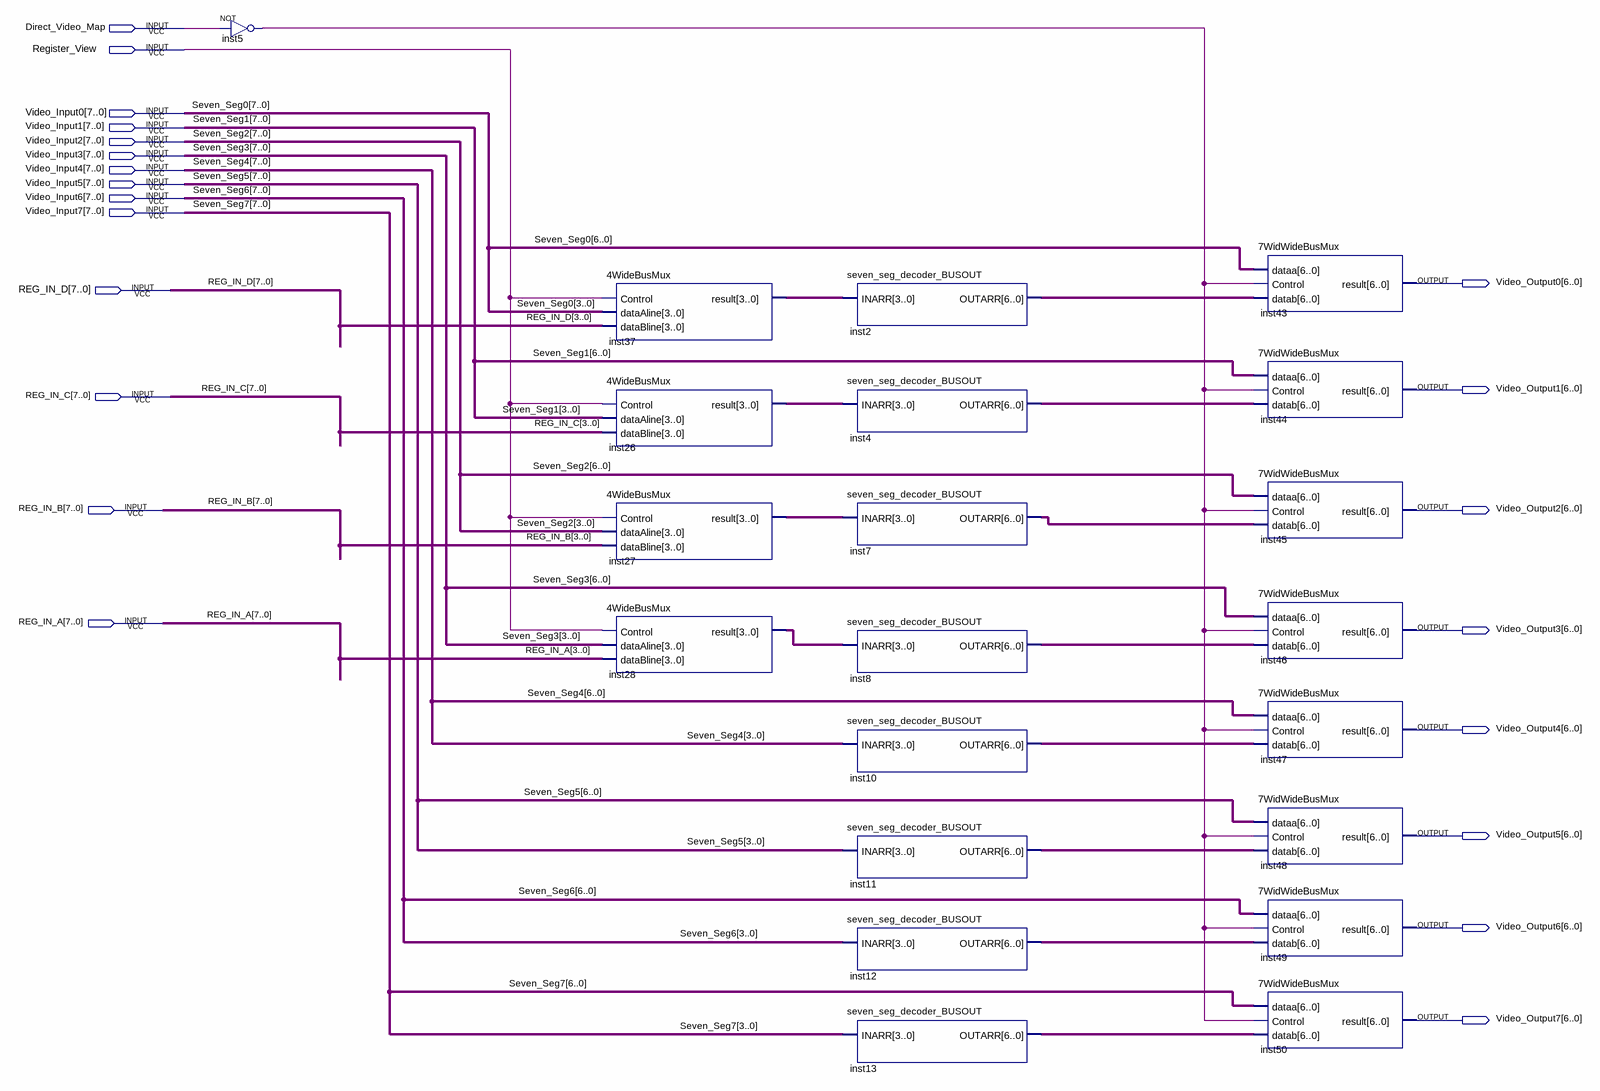
[diagram p0: schematic sheet]
// Quartus schematic Video_Card.bdf as structural Verilog: 21 symbols, 22 pins
module Video_Card (
  input  Direct_Video_Map,
  input  Register_View,
  input  [7:0] Video_Input0,
  input  [7:0] Video_Input1,
  input  [7:0] Video_Input2,
  input  [7:0] Video_Input3,
  input  [7:0] Video_Input4,
  input  [7:0] Video_Input5,
  input  [7:0] Video_Input6,
  input  [7:0] Video_Input7,
  input  [7:0] REG_IN_D,
  input  [7:0] REG_IN_C,
  input  [7:0] REG_IN_B,
  input  [7:0] REG_IN_A,
  output [6:0] Video_Output0,
  output [6:0] Video_Output1,
  output [6:0] Video_Output2,
  output [6:0] Video_Output3,
  output [6:0] Video_Output4,
  output [6:0] Video_Output5,
  output [6:0] Video_Output6,
  output [6:0] Video_Output7
);

  wire inst5_out;
  wire [3:0] inst26_result, inst27_result, inst28_result, inst37_result;
  wire [6:0] inst2_outarr, inst4_outarr, inst7_outarr, inst8_outarr, inst10_outarr, inst11_outarr,
       inst12_outarr, inst13_outarr;

  not inst5 (inst5_out, Direct_Video_Map);
  \4WideBusMux  inst37 (
    .Control(Register_View), .dataAline(Video_Input0[3:0]), .dataBline(REG_IN_D[3:0]), .result(inst37_result));
  \4WideBusMux  inst26 (
    .Control(Register_View), .dataAline(Video_Input1[3:0]), .dataBline(REG_IN_C[3:0]), .result(inst26_result));
  \4WideBusMux  inst27 (
    .Control(Register_View), .dataAline(Video_Input2[3:0]), .dataBline(REG_IN_B[3:0]), .result(inst27_result));
  \4WideBusMux  inst28 (
    .Control(Register_View), .dataAline(Video_Input3[3:0]), .dataBline(REG_IN_A[3:0]), .result(inst28_result));
  seven_seg_decoder_BUSOUT inst2 (.INARR(inst37_result), .OUTARR(inst2_outarr));
  seven_seg_decoder_BUSOUT inst4 (.INARR(inst26_result), .OUTARR(inst4_outarr));
  seven_seg_decoder_BUSOUT inst7 (.INARR(inst27_result), .OUTARR(inst7_outarr));
  seven_seg_decoder_BUSOUT inst8 (.INARR(inst28_result), .OUTARR(inst8_outarr));
  seven_seg_decoder_BUSOUT inst10 (.INARR(Video_Input4[3:0]), .OUTARR(inst10_outarr));
  seven_seg_decoder_BUSOUT inst11 (.INARR(Video_Input5[3:0]), .OUTARR(inst11_outarr));
  seven_seg_decoder_BUSOUT inst12 (.INARR(Video_Input6[3:0]), .OUTARR(inst12_outarr));
  seven_seg_decoder_BUSOUT inst13 (.INARR(Video_Input7[3:0]), .OUTARR(inst13_outarr));
  \7WidWideBusMux  inst43 (
    .Control(inst5_out), .dataa(Video_Input0[6:0]), .datab(inst2_outarr), .result(Video_Output0));
  \7WidWideBusMux  inst44 (
    .Control(inst5_out), .dataa(Video_Input1[6:0]), .datab(inst4_outarr), .result(Video_Output1));
  \7WidWideBusMux  inst45 (
    .Control(inst5_out), .dataa(Video_Input2[6:0]), .datab(inst7_outarr), .result(Video_Output2));
  \7WidWideBusMux  inst46 (
    .Control(inst5_out), .dataa(Video_Input3[6:0]), .datab(inst8_outarr), .result(Video_Output3));
  \7WidWideBusMux  inst47 (
    .Control(inst5_out), .dataa(Video_Input4[6:0]), .datab(inst10_outarr), .result(Video_Output4));
  \7WidWideBusMux  inst48 (
    .Control(inst5_out), .dataa(Video_Input5[6:0]), .datab(inst11_outarr), .result(Video_Output5));
  \7WidWideBusMux  inst49 (
    .Control(inst5_out), .dataa(Video_Input6[6:0]), .datab(inst12_outarr), .result(Video_Output6));
  \7WidWideBusMux  inst50 (
    .Control(inst5_out), .dataa(Video_Input7[6:0]), .datab(inst13_outarr), .result(Video_Output7));

  // Other names for the same wires on the sheet: Seven_Seg0[7:0] = Video_Input0; Seven_Seg1[7:0] = Video_Input1;
  //   Seven_Seg2[7:0] = Video_Input2; Seven_Seg3[7:0] = Video_Input3; Seven_Seg4[7:0] = Video_Input4;
  //   Seven_Seg5[7:0] = Video_Input5; Seven_Seg6[7:0] = Video_Input6; Seven_Seg7[7:0] = Video_Input7
endmodule
